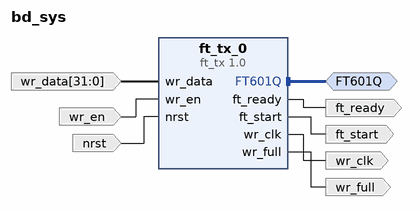
[diagram p0: block diagram of the top level]
# Vivado block design bd_sys, xcvu9p-flga2104-2L-e, Vivado 2019.1
create_bd_design bd_sys

create_bd_intf_port -mode Master -vlnv xilinx.com:user:FT601Q_rtl:1.0 FT601Q
create_bd_port -dir I -from 31 -to 0 wr_data
create_bd_port -dir O wr_full
create_bd_port -dir O wr_clk
create_bd_port -dir I wr_en
create_bd_port -dir I nrst
create_bd_port -dir O ft_ready
create_bd_port -dir O ft_start

create_bd_cell -type ip -vlnv xilinx.com:user:ft_tx:1.0 ft_tx_0

# ---- connections ----

connect_bd_intf_net [get_bd_intf_ports FT601Q] [get_bd_intf_pins ft_tx_0/FT601Q]
connect_bd_net -net wr_data_0_1 [get_bd_ports wr_data] [get_bd_pins ft_tx_0/wr_data]
connect_bd_net [get_bd_pins ft_tx_0/wr_full] [get_bd_ports wr_full]
connect_bd_net [get_bd_pins ft_tx_0/wr_clk] [get_bd_ports wr_clk]
connect_bd_net -net wr_en_0_1 [get_bd_ports wr_en] [get_bd_pins ft_tx_0/wr_en]
connect_bd_net -net nrst_0_1 [get_bd_ports nrst] [get_bd_pins ft_tx_0/nrst]
connect_bd_net [get_bd_pins ft_tx_0/ft_ready] [get_bd_ports ft_ready]
connect_bd_net [get_bd_pins ft_tx_0/ft_start] [get_bd_ports ft_start]

validate_bd_design
save_bd_design
